# Altium schematic sheet main.SCHDOC
size B
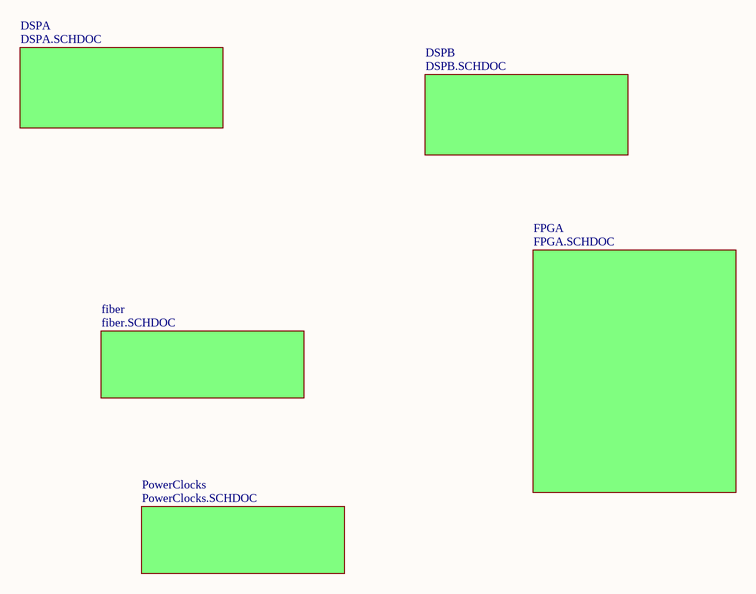
[diagram p0: main.SCHDOC]

## Sub-sheets
DSPA = DSPA.SCHDOC: no entries
DSPB = DSPB.SCHDOC: no entries
fiber = fiber.SCHDOC: no entries
FPGA = FPGA.SCHDOC: no entries
PowerClocks = PowerClocks.SCHDOC: no entries

## Notes on the sheet
- Title:
- Engineer:
- Date:
- Revision:
- Sheet
- of
- File: